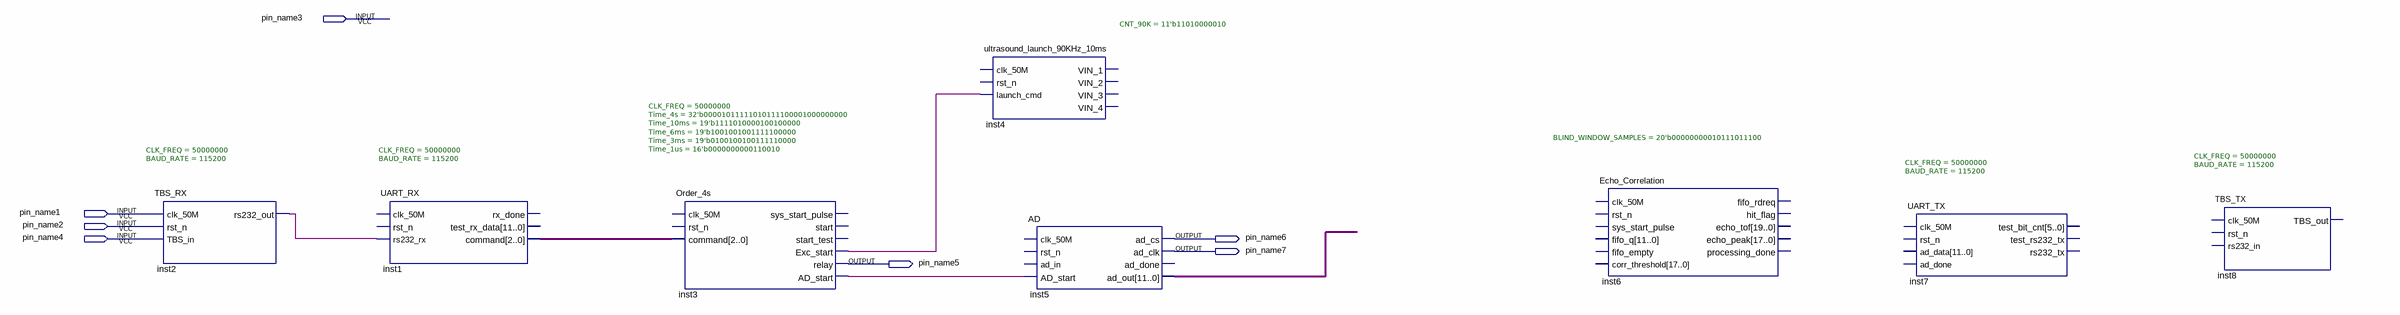
[diagram p0: schematic sheet]
// Quartus schematic Ultrasound_system.bdf as structural Verilog: 8 symbols, 7 pins
module Ultrasound_system (
  input  pin_name3,
  input  pin_name1,
  input  pin_name2,
  input  pin_name4,
  output pin_name6,
  output pin_name7,
  output pin_name5
);

  wire inst2_rs232_out, inst3_ad_start, inst3_exc_start;
  wire [2:0] inst1_command;
  wire [11:0] inst5_ad_out;

  TBS_RX #(.CLK_FREQ(50000000), .BAUD_RATE(115200)) inst2 (
    .clk_50M(pin_name1), .rst_n(pin_name2), .TBS_in(pin_name4), .rs232_out(inst2_rs232_out));
  UART_RX #(.CLK_FREQ(50000000), .BAUD_RATE(115200)) inst1 (
    .rs232_rx(inst2_rs232_out), .command(inst1_command));  // open: clk_50M, rst_n, rx_done, test_rx_data
  Order_4s #(.CLK_FREQ(50000000), .Time_4s(32'b00001011111010111100001000000000), .Time_10ms(19'b1111010000100100000), .Time_6ms(19'b1001001001111100000), .Time_3ms(19'b0100100100111110000), .Time_1us(16'b0000000000110010)) inst3 (
    .command(inst1_command), .Exc_start(inst3_exc_start), .relay(pin_name5), .AD_start(inst3_ad_start));  // open: clk_50M, rst_n, sys_start_pulse, start, start_test
  ultrasound_launch_90KHz_10ms #(.CNT_90K(11'b11010000010)) inst4 (.launch_cmd(inst3_exc_start));  // open: clk_50M, rst_n, VIN_1, VIN_2, VIN_3, VIN_4
  AD inst5 (
    .AD_start(inst3_ad_start), .ad_cs(pin_name6), .ad_clk(pin_name7), .ad_out(inst5_ad_out));  // open: clk_50M, rst_n, ad_in, ad_done
  Echo_Correlation #(.BLIND_WINDOW_SAMPLES(20'b00000000010111011100)) inst6 ();  // open: clk_50M, rst_n, sys_start_pulse, fifo_q, fifo_empty, corr_threshold, fifo_rdreq, hit_flag, echo_tof, echo_peak, processing_done
  UART_TX #(.CLK_FREQ(50000000), .BAUD_RATE(115200)) inst7 ();  // open: clk_50M, rst_n, ad_data, ad_done, test_bit_cnt, test_rs232_tx, rs232_tx
  TBS_TX #(.CLK_FREQ(50000000), .BAUD_RATE(115200)) inst8 ();  // open: clk_50M, rst_n, rs232_in, TBS_out
endmodule
